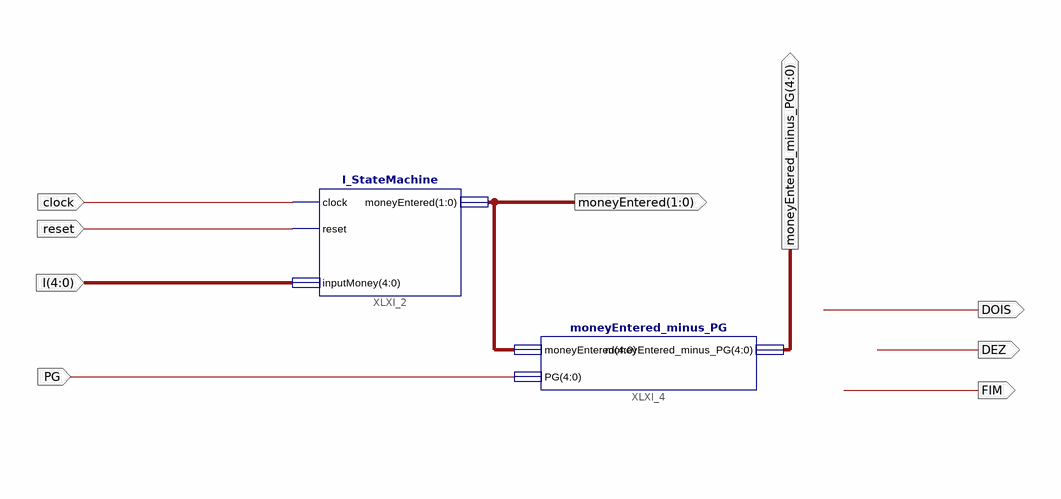
[diagram p0: schematic sheet 1]
// Xilinx ISE schematic DynamicSchematic.sch (artix7) as structural Verilog: 2 symbols, 9 ports
module DynamicSchematic (
  input  PG,
  input  clock,
  input  reset,
  input  [4:0] I,
  output FIM,
  output DOIS,
  output DEZ,
  output [1:0] moneyEntered,
  output [4:0] moneyEntered_minus_PG
);

  I_StateMachine XLXI_2 (.clock(clock), .reset(reset), .moneyEntered(moneyEntered), .inputMoney(I));
  moneyEntered_minus_PG XLXI_4 (
    .moneyEntered(moneyEntered), .PG({5{PG}}), .moneyEntered_minus_PG(moneyEntered_minus_PG));
endmodule
